# EAGLE design m365_led_source (EAGLE 9.1.3)
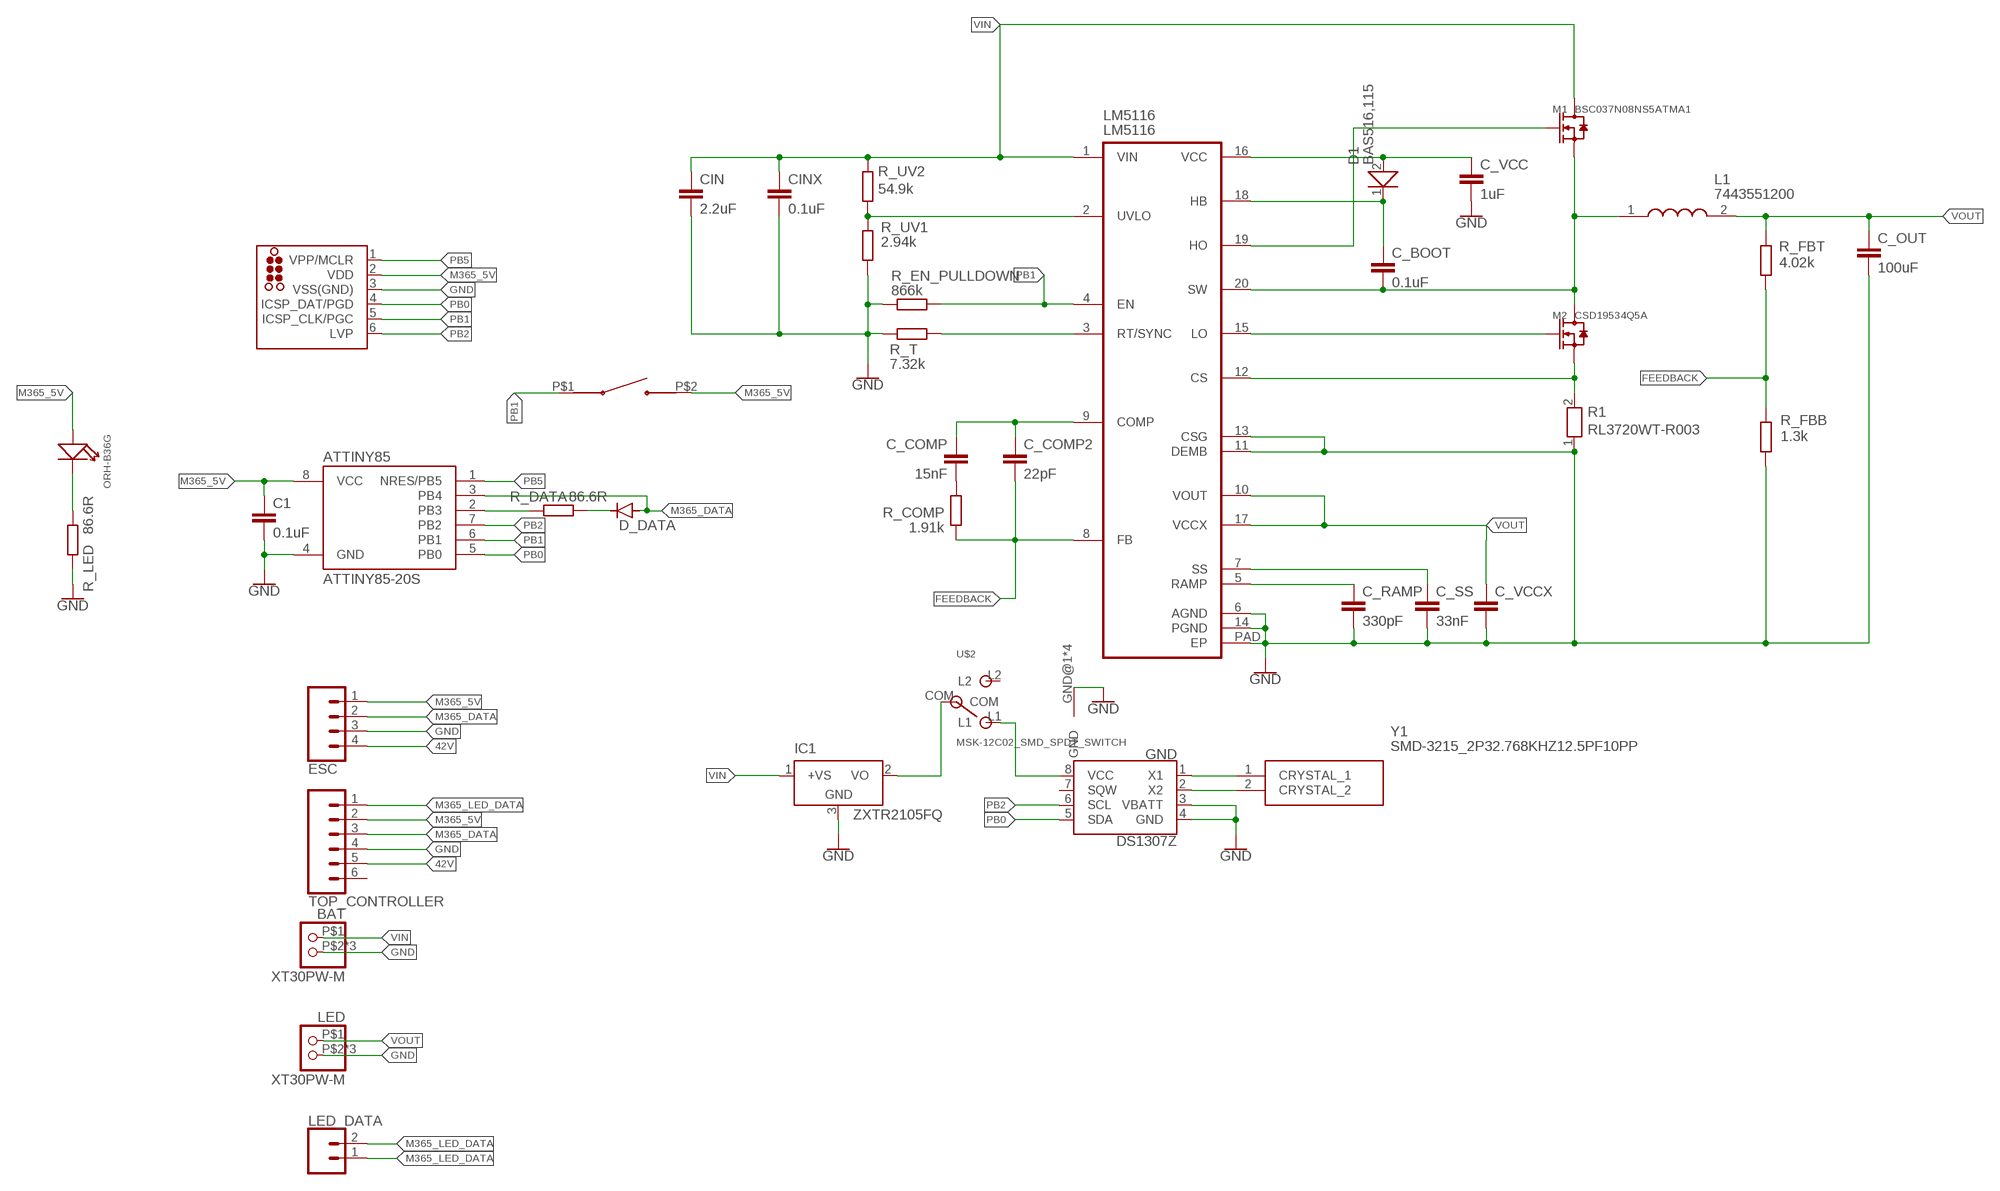
[diagram p0: schematic, sheet 1]

## Parts
ATTINY85  ATTINY85-20S  [SOIC8_EIAJ_208MIL]
BAT  XT30PW-M  [XT30PW-M]
C1  0.1uF  CC0402  [C0402]
C_BOOT  0.1uF  CC0603  [C0603]
C_COMP  15nF  CC1005  [C1005]
C_COMP2  22pF  CC0402  [C0402]
C_OUT  100uF  CC1210  [C1210]
C_RAMP  330pF  CC0402  [C0402]
C_SS  33nF  CC0402  [C0402]
C_VCC  1uF  CC0402  [C0402]
C_VCCX  CC0402  [C0402]
CIN  2.2uF  CC1210  [C1210]
CINX  0.1uF  CC0603  [C0603]
D1  BAS516,115  [SOD1608X65N]
D_DATA  SMAFJ75A  [SMAFJ75A]
ESC  CONN_04LONGPADS  [1X04_LONGPADS]
GND  DS1307Z  [SO08-0.15]
IC1  ZXTR2105FQ  LM50  [SOT23]
J2  TC2030-MCP-NL  [TC2030-MCP-NL]
L1  7443551200  [WE-HCI_1350/136523]
LED  XT30PW-M  [XT30PW-M]
LED_DATA  CONN_02PTH3  [1X02_LONGPADS]
LM5116  LM5116  [TSSOP20-PAD]
M1  BSC037N08NS5ATMA1  CSD19534Q5A  [CSD19531Q5AT]
M2  CSD19534Q5A  [CSD19531Q5AT]
R1  RL3720WT-R003  RL3720WT-R005-F  [RESC2038X70N]
R_COMP  1.91k  RR0402  [R0402]
R_DATA  86.6R  RR0402  [R0402]
R_EN_PULLDOWN  866k  RR0402  [R0402]
R_FBB  1.3k  RR1206  [R1206]
R_FBT  4.02k  RR1206  [R1206]
R_LED  86.6R  RR0402  [R0402]
R_T  7.32k  RR0402  [R0402]
R_UV1  2.94k  RR0402  [R0402]
R_UV2  54.9k  RR0402  [R0402]
TINY_LED  ORH-B36G  SMD-LED-CLEAR-BLUE(0603)  [LED-0603]
TOP_CONTROLLER  CONN_06LONGPADS  [1X06_LONGPADS]
U$1  TL3302BF260QJ  [TL3302BF260QJ]
U$2  MSK-12C02_SMD_SPDT_SWITCH  [MSK-12C02]
Y1  SMD-3215_2P32.768KHZ12.5PF10PP  [SMD3215_2P32768KHZ125PF10PPM]

## Nets
5V_REG: IC1.2(VO) U$2.COM
42V: ESC.4 TOP_CONTROLLER.5
FEEDBACK: C_COMP2.2 LM5116.8(FB) R_COMP.1 R_FBB.2 R_FBT.1
GND: ATTINY85.4(GND) BAT.P$2 BAT.P$3 BAT.P$4 C1.2 C_OUT.2 C_RAMP.2 C_SS.2 C_VCC.2 C_VCCX.2 CIN.2 CINX.2 ESC.3 GND.3(VBATT) GND.4(GND) IC1.3(GND) J2.3(VSS(GND)) LED.P$2 LED.P$3 LED.P$4 LM5116.6(AGND) LM5116.11(DEMB) LM5116.13(CSG) LM5116.14(PGND) LM5116.PAD(EP) R1.1 R_EN_PULLDOWN.1 R_FBB.1 R_LED.1 R_T.1 R_UV1.1 TOP_CONTROLLER.4 U$2.GND@1(GND) U$2.GND@2(GND) U$2.GND@3(GND) U$2.GND@4(GND)
M365_5V: ATTINY85.8(VCC) C1.1 ESC.1 J2.2(VDD) TINY_LED.+ TOP_CONTROLLER.2 U$1.P$2
M365_DATA: ATTINY85.3(PB4) D_DATA.P$2(ANODE) ESC.2 TOP_CONTROLLER.3
M365_LED_DATA: LED_DATA.1 LED_DATA.2 TOP_CONTROLLER.1
N$1: C_COMP.2 R_COMP.2
N$2: LM5116.2(UVLO) R_UV1.2 R_UV2.1
N$3: GND.8(VCC) U$2.L1
N$4: LM5116.3(RT/SYNC) R_T.2
N$5: C_COMP2.1 C_COMP.1 LM5116.9(COMP)
N$6: GND.1(X1) Y1.1(CRYSTAL_1)
N$7: C_SS.1 LM5116.7(SS)
N$8: C_RAMP.1 LM5116.5(RAMP)
N$9: R_LED.2 TINY_LED.-
N$10: D_DATA.P$1(CATHODE) R_DATA.2
N$11: GND.2(X2) Y1.2(CRYSTAL_2)
N$16: LM5116.12(CS) M2.1(S) M2.2(S) M2.3(S) R1.2
N$17: LM5116.15(LO) M2.4(G)
N$18: C_BOOT.2 L1.1 LM5116.20(SW) M1.1(S) M1.2(S) M1.3(S) M2.5(D) M2.6(D) M2.7(D) M2.8(D) M2.9(D)
N$19: LM5116.19(HO) M1.4(G)
N$20: C_BOOT.1 D1.1 LM5116.18(HB)
N$21: C_VCC.1 D1.2 LM5116.16(VCC)
PB0: ATTINY85.5(PB0) GND.5(SDA) J2.4(ICSP_DAT/PGD)
PB1: ATTINY85.6(PB1) J2.5(ICSP_CLK/PGC) LM5116.4(EN) R_EN_PULLDOWN.2 U$1.P$1
PB2: ATTINY85.7(PB2) GND.6(SCL) J2.6(LVP)
PB3: ATTINY85.2(PB3) R_DATA.1
PB5: ATTINY85.1(NRES/PB5) J2.1(VPP/MCLR)
VIN: BAT.P$1 CIN.1 CINX.1 IC1.1(+VS) LM5116.1(VIN) M1.5(D) M1.6(D) M1.7(D) M1.8(D) M1.9(D) R_UV2.2
VOUT: C_OUT.1 C_VCCX.1 L1.2 LED.P$1 LM5116.10(VOUT) LM5116.17(VCCX) R_FBT.2
Unconnected: GND.7(SQW) TOP_CONTROLLER.6 U$2.L2

## Library data of the parts
ATTINY85 = attiny25_45_85:ATTINY85*: ATMEL ATtiny 85 Packages: P = PDIP 08 30mil S = SOIC 08 EIAJ 208mil Technologies Note: for complete ordering code (temp. range, finish, tape&reel etc.) see www.atmel.com • Supply Voltage: V = (1.8…5.5)V | [blank] = (2.7…5.5)V • Speed: 10 = 10 MHz | 20 = 20 MHz Author: Dipl.-Ing. FH Rainer Bayer HHN Hochschule Heilbronn (Heilbronn University), rainer.bayer@hs-heilbronn.de Ingenieurbüro ing-rb, mail@ing-rb.de
BAT LED = my-lib:XT30PW-M
C1 C_BOOT C_COMP C_COMP2 C_OUT C_RAMP C_SS C_VCC C_VCCX CIN CINX = eagle-ltspice:C: CAPACITOR, European symbol; SPICEMODEL: NONE; SPICEPREFIX: C
D1 = BAS516_115:BAS516,115: NXP - BAS516,115 - DIODE, SWITCHING, 150MA, 100V, SOD-523 Source: Datasheet <http://www.mouser.com/ds/2/302/BAS16_SER-839896.pdf>; DESCRIPTION: NXP - BAS516,115 - DIODE, SWITCHING, 150MA, 100V, SOD-523; HEIGHT: 0.65mm; MANUFACTURER_NAME: Nexperia; MANUFACTURER_PART_NUMBER: BAS516,115; MOUSER_PART_NUMBER: 771-BAS516-T/R; MOUSER_PRICE-STOCK: https://www.mouser.com/Search/Refine.aspx?Keyword=771-BAS516-T%2FR; RS_PART_NUMBER: 0508282; RS_PRICE-STOCK: http://uk.rs-online.com/web/p/products/0508282
D_DATA = my-lib:SMAFJ75A
ESC = SparkFun-Connectors:CONN_04: Multi connection point. Often used as Generic Header-pin footprint for 0.1 inch spaced/style header connections On any of the 0.1 inch spaced packages, you can populate with these: Break Away Headers - Straight <https://www.sparkfun.com/products/116> (PRT-00116) Break Away Male Headers - Right Angle <https://www.sparkfun.com/products/553> (PRT-00553) Female Headers <https://www.sparkfun.com/products/115> (PRT-00115) Break Away Headers - Machine Pin <https://www.sparkfun.com/products/117> (PRT-00117) Break Away Female Headers - Swiss Machine Pin <https://www.sparkfun.com/products/743> (PRT-00743) For SCREWTERMINALS and SPRING TERMINALS visit here: Screw Terimnals on SparkFun.com <https://www.sparkfun.com/search/results?term=Screw+Terminals> (5mm/3.5mm/2.54mm spacing) This device is also useful as a general connection point to wire up your design to another part of your project. Our various solder wires solder well into these plated through hole pads. Hook-Up Wire - Assortment (Stranded, 22 AWG) <https://www.sparkfun.com/products/11375> (PRT-11375) Hook-Up Wire - Assortment (Solid Core, 22 AWG) <https://www.sparkfun.com/products/11367> (PRT-11367) View the entire wire category on our website here <https://www.sparkfun.com/categories/141> Special notes: Molex polarized connector foot print use with SKU : PRT-08231 with associated crimp pins and housings. 1MM SMD Version SKU: PRT-10208; PROD_ID: CONN-09696
GND = SparkFun-Clocks:DS1307: Maxim DS1307 - I2C Real-time clock (RTC) The DS1307 serial real-time clock (RTC) is a low-power, full binary-coded decimal (BCD) clock/calendar plus 56 bytes of NV SRAM. Address and data are transferred serially through an I2C, bidirectional bus. The clock/calendar provides seconds, minutes, hours, day, date, month, and year information. SparkFun Products: Real Time Clock Module <https://www.sparkfun.com/products/12708> (BOB-12708) Datasheet <https://cdn.sparkfun.com/datasheets/BreakoutBoards/DS1307.pdf>; PROD_ID: IC-08138
IC1 = linear:LM50: SOT-23 Single-Supply Centigrade Temperature Sensor Vout = (10mV/°C x Temp °C) +5mmmV Source: http://cache.national.com/ds/LM/LM50.pdf
J2 = tag-connect:TC2030: TAG-CONNECT ICSP Connector Manufacturer: Tag-Connect <http://www.tag-connect.com> Cable for easy In-Circuit Serial Programming. Designed for Microchip ICD2, suitable for many others. Two variants - one "with legs" (for hands-free fit on PCB) and another "without legs" for quick programming. PAD Description 1 MCLR/Vpp 2 Vdd 3 GND 4 PGD (ISPDAT) 5 PGC (ISPCLK) 6 nc (used for LVP) ©2009 ROFA.cz - modified and updated by Robert Darlington ‹rdarlington@gmail.com›
L1 = 7443551200:7443551200: Wurth WE-HCI Series Shielded Wire-wound SMD Inductor with a WE-Perm Core, 2 uH +/-20% Flat Wire Winding 23A Idc Source: Datasheet; DESCRIPTION: Wurth WE-HCI Series Shielded Wire-wound SMD Inductor with a WE-Perm Core, 2 uH +/-20% Flat Wire Winding 23A Idc; HEIGHT: mm; MANUFACTURER_NAME: Wurth Elektronik; MANUFACTURER_PART_NUMBER: 7443551200; MOUSER_PART_NUMBER: 710-7443551200; MOUSER_PRICE-STOCK: https://www.mouser.com/Search/Refine.aspx?Keyword=710-7443551200; RS_PART_NUMBER: 7362049P; RS_PRICE-STOCK: http://uk.rs-online.com/web/p/products/7362049P
LED_DATA = SparkFun-Connectors:CONN_02: Multi connection point. Often used as Generic Header-pin footprint for 0.1 inch spaced/style header connections On any of the 0.1 inch spaced packages, you can populate with these: Break Away Headers - Straight <https://www.sparkfun.com/products/116> (PRT-00116) Break Away Male Headers - Right Angle <https://www.sparkfun.com/products/553> (PRT-00553) Female Headers <https://www.sparkfun.com/products/115> (PRT-00115) Break Away Headers - Machine Pin <https://www.sparkfun.com/products/117> (PRT-00117) Break Away Female Headers - Swiss Machine Pin <https://www.sparkfun.com/products/743> (PRT-00743) For SCREWTERMINALS and SPRING TERMINALS visit here: Screw Terimnals on SparkFun.com <https://www.sparkfun.com/search/results?term=Screw+Terminals> (5mm/3.5mm/2.54mm spacing) This device is also useful as a general connection point to wire up your design to another part of your project. Our various solder wires solder well into these plated through hole pads. Hook-Up Wire - Assortment (Stranded, 22 AWG) <https://www.sparkfun.com/products/11375> (PRT-11375) Hook-Up Wire - Assortment (Solid Core, 22 AWG) <https://www.sparkfun.com/products/11367> (PRT-11367) View the entire wire category on our website here <https://www.sparkfun.com/categories/141> Special notes: Molex polarized connector foot print use with: PRT-08233 with associated crimp pins and housings. 2.54_SCREWTERM for use with PRT-10571. 3.5mm Screw Terminal footprints for PRT-08084 5mm Screw Terminal footprints for use with PRT-08432
LM5116 = newchips:LM5116: NS Wide Range Synchronous Buck Controller
M1 M2 = CSD19534Q5A:CSD19534Q5A: 100V, N ch NexFET MOSFET, single SON5x6, 15.1mOhm Source: Datasheet <http://www.ti.com/lit/ds/symlink/csd19534q5a.pdf>; DESCRIPTION: 100V, N ch NexFET MOSFET, single SON5x6, 15.1mOhm; HEIGHT: 1mm; MANUFACTURER_NAME: Texas Instruments; MANUFACTURER_PART_NUMBER: CSD19534Q5A; MOUSER_PART_NUMBER: 595-CSD19534Q5A; MOUSER_PRICE-STOCK: https://www.mouser.com/Search/Refine.aspx?Keyword=595-CSD19534Q5A
R1 = RL3720WT-R005-F:RL3720WT-R005-F: Current Sense Resistors - SMD 1W 0.005ohm 1% Source: Datasheet <http://www.mouser.com/ds/2/392/n_catalog_partition07_en-1114612.pdf>; DESCRIPTION: Current Sense Resistors - SMD 1W 0.005ohm 1%; HEIGHT: 0.7mm; MANUFACTURER_NAME: Susumu; MANUFACTURER_PART_NUMBER: RL3720WT-R005-F; MOUSER_PART_NUMBER: 754-RL3720WT-R005-F; MOUSER_PRICE-STOCK: https://www.mouser.com/Search/Refine.aspx?Keyword=754-RL3720WT-R005-F
R_COMP R_DATA R_EN_PULLDOWN R_FBB R_FBT R_LED R_T R_UV1 R_UV2 = eagle-ltspice:R: RESISTOR, European symbol; SPICEMODEL: NONE; SPICEPREFIX: R
TINY_LED = Seeed-LED:SMD-LED-CLEAR-BLUE(0603): 304090045; MPN: 19-217-BHC-ZL1M2RY-3T; VALUE: BLUE-0603
TOP_CONTROLLER = SparkFun-Connectors:CONN_06: Multi connection point. Often used as Generic Header-pin footprint for 0.1 inch spaced/style header connections On any of the 0.1 inch spaced packages, you can populate with these: Break Away Headers - Straight <https://www.sparkfun.com/products/116> (PRT-00116) Break Away Male Headers - Right Angle <https://www.sparkfun.com/products/553> (PRT-00553) Female Headers <https://www.sparkfun.com/products/115> (PRT-00115) Break Away Headers - Machine Pin <https://www.sparkfun.com/products/117> (PRT-00117) Break Away Female Headers - Swiss Machine Pin <https://www.sparkfun.com/products/743> (PRT-00743) Arduino Stackable Header - 6 Pin <https://www.sparkfun.com/products/9280> (PRT-09280) For SCREWTERMINALS and SPRING TERMINALS visit here: Screw Terimnals on SparkFun.com <https://www.sparkfun.com/search/results?term=Screw+Terminals> (5mm/3.5mm/2.54mm spacing) This device is also useful as a general connection point to wire up your design to another part of your project. Our various solder wires solder well into these plated through hole pads. Hook-Up Wire - Assortment (Stranded, 22 AWG) <https://www.sparkfun.com/products/11375> (PRT-11375) Hook-Up Wire - Assortment (Solid Core, 22 AWG) <https://www.sparkfun.com/products/11367> (PRT-11367) View the entire wire category on our website here <https://www.sparkfun.com/categories/141>
U$1 = my-lib:TL3302BF260QJ
U$2 = MSK-12C02 SMD Micro Slider Switch SPDT:MSK-12C02_SMD_SPDT_SWITCH: Footprint of the VIMEX MSK-12C02 SPDT SMD Switch Created by mzst on 17-Jan-2016
Y1 = SMD-3215_2P32.768KHZ12.5PF10PP:SMD-3215_2P32.768KHZ12.5PF10PP: SMD Crystal Resonators 32.768KHz +/-10ppm SMD-3215_2P RoHS Source: Datasheet <https://datasheet.lcsc.com/szlcsc/Zhejiang-Abel-Elec-SMD-3215-2P32-768KHZ12-5PF10PPM_C164062.pdf>; DESCRIPTION: SMD Crystal Resonators 32.768KHz +/-10ppm SMD-3215_2P RoHS; HEIGHT: 0.8mm; MANUFACTURER_NAME: Zhejiang Abel Elec; MANUFACTURER_PART_NUMBER: SMD-3215_2P32.768KHZ12.5PF10PPM

## Board
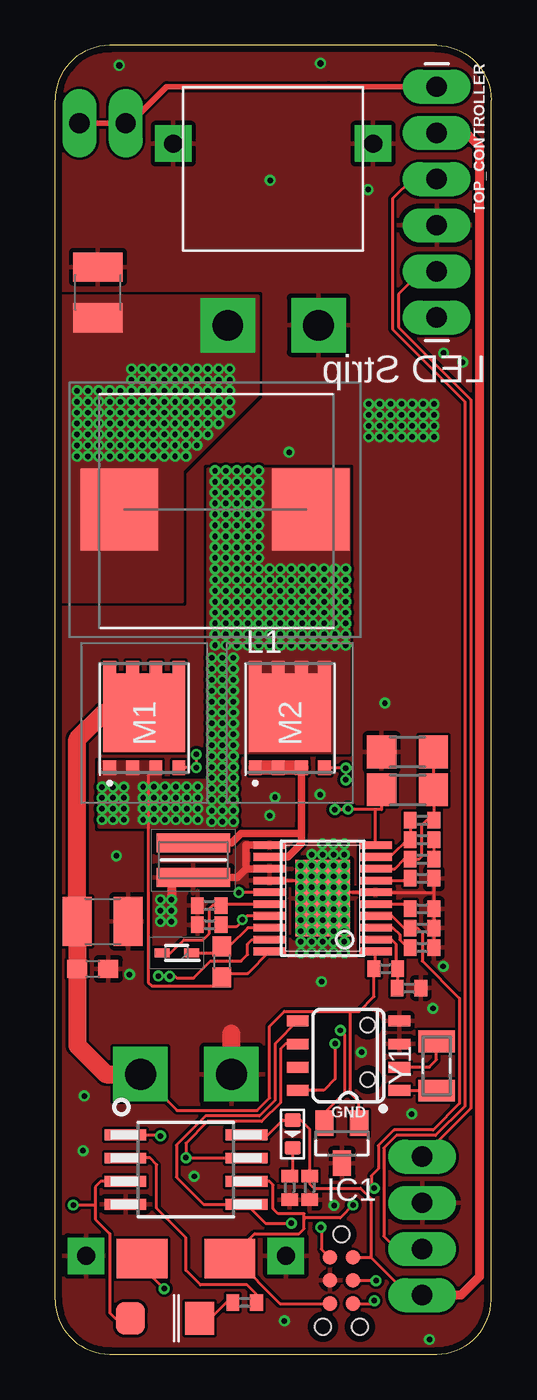
[diagram p1: board, top side]
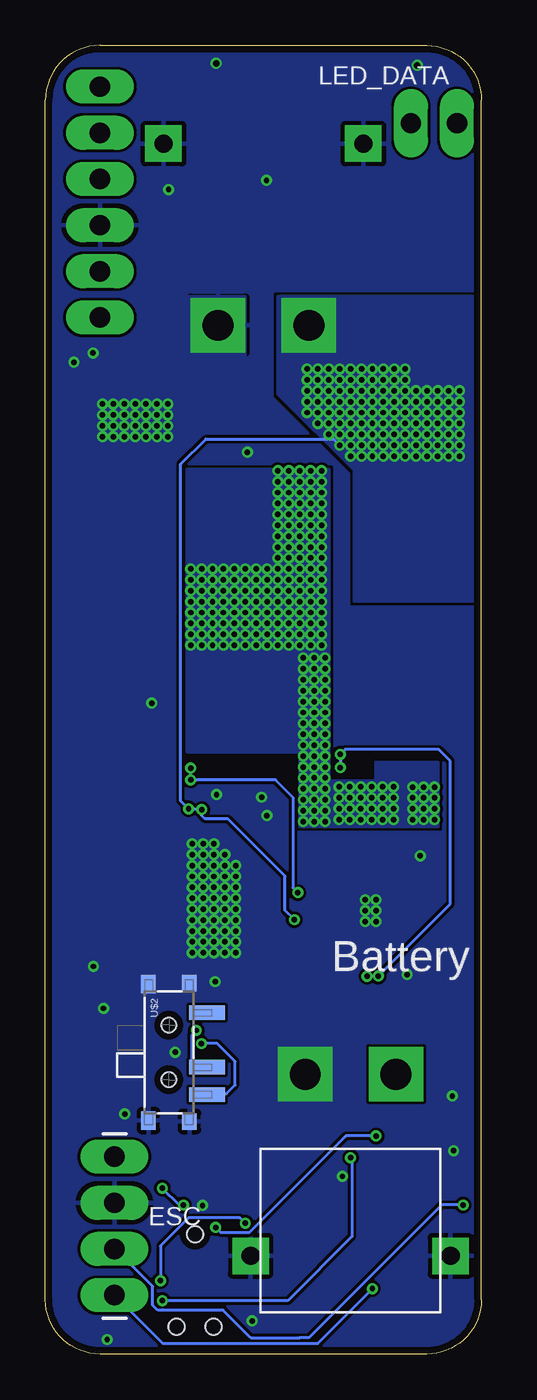
[diagram p2: board, bottom side, seen from below]

Size 24 x 72 mm. Coordinates in mm from the lower left corner, seen from the top.
Outline: 3,0 21,0 arc90 24,3 24,69 arc90 21,72 3,72 arc90 0,69 0,3 arc90 3,0
Copper layers (1*16): Top 0.035559375mm / dielectric 1.6mm / Bottom 0.035559375mm
Design rules "oshpark-2layer": minimum track width 6mil, minimum drill 10mil, track to track 6mil, track to pad 6mil, pad to pad 6mil, via to via 6mil, smd to smd 6mil, copper to edge 15mil, drill to drill 6mil, minimum pad ring 5mil, minimum via ring 5mil, stop-mask expansion 2.5mil, vias tented up to drill 0mil, thermal gap 10mil

### Footprints (pad centres in the part's own frame; a part is rotated, then mirrored left to right if it is on the bottom)
SOIC8_EIAJ_208MIL = smd 0.6 x 2.286: 1 -1.905,-3.33; 2 -0.635,-3.33; 3 0.635,-3.33; 4 1.905,-3.33; 5 1.905,3.33; 6 0.635,3.33; 7 -0.635,3.33; 8 -1.905,3.33
XT30PW-M = drill 1.7 pad 3 square: P$1 0,-2.5; P$2 0,2.5 | drill 1 pad 2 square: P$3 -10,5.5; P$4 -10,-5.5
C0402 = smd 0.7 x 0.9: 1 -0.65,0; 2 0.65,0
C0603 = smd 1.1 x 1: 1 -0.85,0; 2 0.85,0
C1005 = smd 0.7 x 0.9: 1 -0.65,0; 2 0.65,0
C1210 = smd 1.6 x 2.7: 1 -1.4,0; 2 1.4,0
SOD1608X65N = smd 0.818 x 0.5: 1 -0.808,0; 2 0.808,0
SMAFJ75A = smd 1.6 x 1.8: P$1 1.9,0; P$2 -1.9,0
1X04_LONGPADS = drill 1.118 pad 1.88 long: 1 0,0; 2 2.54,0; 3 5.08,0; 4 7.62,0
SO08-0.15 = smd 0.6 x 1.2: 1 -1.905,-2.8; 2 -0.635,-2.8; 3 0.635,-2.8; 4 1.905,-2.8; 5 1.905,2.8; 6 0.635,2.8; 7 -0.635,2.8; 8 -1.905,2.8
SOT23 = smd 1 x 1.4: 1 -0.95,-1.1; 2 0.95,-1.1; 3 0,1.1
TC2030-MCP-NL = smd 0.787 x 0.787: 1 1.27,-0.635; 2 1.27,0.635; 3 2.54,-0.635; 4 2.54,0.635; 5 3.81,-0.635; 6 3.81,0.635 | hole 0.889: 0,0; 5.08,-1.016; 5.08,1.016
WE-HCI_1350/136523 = smd 4.25 x 4.5: 1 -5.25,0; 2 5.27,0
1X02_LONGPADS = drill 1.118 pad 1.88 long: 1 0,0; 2 2.54,0
TSSOP20-PAD = smd 0.42 x 1.78: 1 -2.925,-2.918; 2 -2.275,-2.918; 3 -1.625,-2.918; 4 -0.975,-2.918; 5 -0.325,-2.918; 6 0.325,-2.918; 7 0.975,-2.918; 8 1.625,-2.918; 9 2.275,-2.918; 10 2.925,-2.918; 11 2.925,2.918; 12 2.275,2.918; 13 1.625,2.918; 14 0.975,2.918; 15 0.325,2.918; 16 -0.325,2.918; 17 -0.975,2.918; 18 -1.625,2.918; 19 -2.275,2.918; 20 -2.925,2.918 | smd 4.2 x 3: PAD 0,0
CSD19531Q5AT = smd 0.8 x 0.7: 1 -2.451,1.905; 2 -2.451,0.635; 3 -2.451,-0.635; 4 -2.451,-1.905 | smd 0.68 x 0.7: 5 3.064,-1.905; 6 3.064,-0.635; 7 3.064,0.635; 8 3.064,1.905 | smd 4.32 x 4.51: 9 0.564,0
RESC2038X70N = smd 1.05 x 4.05: 1 -0.95,0; 2 0.95,0
R0402 = smd 0.7 x 0.9: 1 -0.65,0; 2 0.65,0
R1206 = smd 1.6 x 1.803: 1 -1.422,0; 2 1.422,0
LED-0603 = smd 0.762 x 0.889: + -0.762,0; - 0.762,0
1X06_LONGPADS = drill 1.118 pad 1.88 long: 1 0,0; 2 2.54,0; 3 5.08,0; 4 7.62,0; 5 10.16,0; 6 12.7,0
TL3302BF260QJ = smd 2.795 x 2.16: P$1 -2.413,0; P$2 2.413,0
MSK-12C02 = smd 0.8 x 2: COM 0.823,2.1; L1 2.323,2.1; L2 -2.177,2.1 | smd 1 x 0.8: GND@1 -3.75,-1.125; GND@4 3.75,-1.125 | smd 0.9 x 0.8: GND@2 -3.8,1.125; GND@3 3.8,1.125 | hole 0.8: -1.5,0; 1.5,0
SMD3215_2P32768KHZ125PF10PPM = smd 1.2 x 2: 1 -1.35,0; 2 1.35,0

### Placement (x,y rotation side)
ATTINY85  7.2,10.15 270 top
BAT  7.2,15.4 90 bottom
C1  14.01,9.15 270 top
C_BOOT  9.17,21.58 270 top
C_COMP  20.19,28.3 0 top
C_COMP2  20.19,29.38 0 top
C_OUT  2.35,58.41 90 top
C_RAMP  20.19,24.5 0 top
C_SS  20.19,26.18 0 top
C_VCC  8.48,24.68 180 top
C_VCCX  8.48,23.62 180 top
CIN  2.62,23.81 0 top
CINX  2.07,21.19 0 top
D1  6.69,22.08 180 top
D_DATA  6.04,1.97 0 top
ESC  20.2,3.24 90 bottom
GND  16.15,16.42 90 top
IC1  15.78,11.6 180 top
J2  15.75,6.59 270 top
L1  8.81,46.46 180 top
LED  12,56.6 270 top
LED_DATA  3.88,67.72 0 bottom
LM5116  14.72,25.08 90 top
M1  4.9,34.72 90 top
M2  12.92,34.72 90 top
R1  7.6,27.18 90 top
R_COMP  20.19,27.23 0 top
R_DATA  10.43,2.84 180 top
R_EN_PULLDOWN  20.19,23.44 180 top
R_FBB  19.39,33.12 0 top
R_FBT  19.39,31.05 180 top
R_LED  12.91,9.15 90 top
R_T  20.19,22.37 180 top
R_UV1  19.48,20.14 180 top
R_UV2  18.2,21.2 180 top
TINY_LED  13.07,12.11 270 top
TOP_CONTROLLER  21,69.73 270 top
U$1  7.2,5.26 180 top
U$2  17.2,16.6 270 bottom
Y1  20.99,15.85 90 top

### Tracks (layer width: path | path; a pad name or v marks a point on that pad's centre or on a via)
5V_REG  (via drill 0.3 pad 0.6)
  Top 0.152: IC1.2 14.83,13.28 15.94,14.39 15.94,17.56 v15.69,17.81
  Bottom 0.152: v15.69,17.81 15.94,17.56 15.94,15.98 15.74,15.78 U$2.COM
42V
  Top 0.152: ESC.4 22.87,13.53 22.87,52.51 18.89,56.49 18.89,58.31 20.15,59.57 TOP_CONTROLLER.5
FEEDBACK
  Top 0.152: 17.66,26.73 LM5116.8 18.7,26.7 19.22,27.23 R_COMP.1 20.04,27.23 20.19,27.38 20.19,29.12 20.45,29.38 C_COMP2.2 20.84,31.03 R_FBT.1 R_FBB.2
GND  (via drill 0.3 pad 0.6, 0.35)
  Top 0.152: LM5116.14 14.14,26.05 | 14.72,25.4 14.72,25.48 14.14,26.05 | 14.72,25.4 LM5116.PAD | 13.49,26.7 14.14,26.05 | LM5116.6 14.72,25.41 14.72,25.4 | R_EN_PULLDOWN.1 | LM5116.6 | C_SS.2 20.84,25.4 | 20.84,25.4 C_RAMP.2 R_EN_PULLDOWN.1 | R_EN_PULLDOWN.1 R_T.1 | 20.84,25.4 20.84,25.41 LM5116.6 | R_LED.1 12.72,8.5
  Top 0.406: 10.5,26.7 LM5116.13 | LM5116.11 10.5,28 10.5,26.7 | 10.5,26.7 10.5,26.69 10.04,26.23 R1.1
  Top 0.5: v6.4,25 6.4,26.04 6.59,26.23 R1.1
  Top 1: BAT.P$2 9.7,17.64
  other vias: 4.09,20.88 11.81,29.63 17.26,51.67 17.86,51.67 18.46,51.67 17.26,52.27 17.86,52.27 18.46,52.27 19.06,52.27 19.66,52.27 20.26,52.27 20.86,52.27 19.06,51.67 19.66,51.67 20.26,51.67 20.86,51.67 20.26,51.07 20.86,51.07 20.26,50.47 20.86,50.47 19.66,51.07 15.92,23.28 13.52,23.28 14.12,23.28 14.72,23.28 15.32,23.28 15.92,26.88 13.52,26.88 14.12,26.88 14.72,26.88 15.32,26.88 15.92,26.28 13.52,26.28 14.12,26.28 14.72,26.28 15.32,26.28 15.92,25.68 13.52,25.68 14.12,25.68 14.72,25.68 15.32,25.68 15.92,25.08 13.52,25.08 14.12,25.08 14.72,25.08 15.32,25.08 15.92,24.48 13.52,24.48 14.12,24.48 14.72,24.48 15.32,24.48 15.92,23.88 13.52,23.88 14.12,23.88 14.72,23.88 15.32,23.88 15.92,28.08 14.72,28.08 15.32,28.08 15.92,27.48 14.12,27.48 14.72,27.48 15.32,27.48 15.92,22.68 13.52,22.68 14.12,22.68 14.72,22.68 15.32,22.68 15.92,22.08 13.52,22.08 14.12,22.08 14.72,22.08 15.32,22.08 14.58,30.78 12.1,30.64 5.8,25 5.8,24.4 6.4,24.4 6.4,23.8 5.8,23.8 12.88,49.62 3.37,27.41 20.6,0.8 1.6,14.2 12.62,1.83 17.26,50.47 17.86,50.47 18.46,50.47 17.26,51.07 17.86,51.07 18.46,51.07 19.06,51.07 19.06,50.47 19.66,50.47 18.15,35.82 22.43,54.57 21.38,55.08 11.83,64.58 17.22,64.07 21.36,21.33 14.6,71.01 3.53,70.9 7.65,9.78 15.35,8.18 20.8,19.02 1.53,11.19 14.66,20.49 19.63,13.21 16.86,16.61
  pour Top (rank 6): -12,-0.6 -12,-3.6 32.8,-3.6 32.8,73.4 24.8,73.4 -11.8,73.4 -11.8,-0.4
  pour Bottom (rank 6): -12.2,-0.6 -12.2,-3.6 32.6,-3.6 32.6,73.4 24.6,73.4 -12,73.4 -12,-0.4
  pour Bottom (no thermals): 8.2,13.4 12.8,13.4 13.2,13.8 13.2,19 13.8,19.6 23.2,19.6 25.6,19.6 26.2,20.2 26.2,58.2 13,58.2 13,53.6 17.2,49.4 17.2,29.8 16.4,29 14.4,29 11.6,26.2 11.6,24 7.6,20 7.6,19.8 7.6,13.8 8,13.4
M365_5V  (via drill 0.3 pad 0.6)
  Top 0.152: 12.91,13.03 TINY_LED.+ | ATTINY85.8 11.7,12.05 12.52,12.87 TINY_LED.+ | J2.2 17.2,5.32 17.37,5.32 | 17.37,5.32 17.39,5.32 19.47,3.24 ESC.1 | v6,3.6 4.79,4.81 U$1.P$2 | TINY_LED.+ 13.53,12.87 14.01,12.39 C1.1 14.01,9.37 14.25,9.13 16.81,9.13 17.37,8.57 17.37,5.32
  Top 0.5: 22.61,67.19 23.35,66.45 23.35,4.26 22.33,3.24 ESC.1
  Top 0.508: TOP_CONTROLLER.2 22.61,67.19
  Bottom 0.152: ESC.1 17.56,0.6 9,0.6 v6,3.6
M365_DATA  (via drill 0.3 pad 0.6)
  Top 0.152: D_DATA.P$2 3.29,1.97 3,2.26 3,6.62 2.2,7.42 2.2,8.2 | ATTINY85.3 2.52,9.52 2.2,9.2 2.2,8.2 | TOP_CONTROLLER.3 19.65,64.65 18.57,63.57 18.57,56.38 22.56,52.39 22.56,13.65 20.94,12.03 18.78,12.03 18.09,11.34 18.09,6.49 18.8,5.78 ESC.2 | v1,8.2 2.2,8.2
  Bottom 0.152: v1,8.2 2.19,8.2 9.48,0.91 10,0.91 12.71,0.91 14.21,2.41 17.81,2.41 18.09,2.69 18.09,3.72 20.15,5.78 ESC.2
M365_LED_DATA
  Top 0.152: 15.05,69.73
  Top 0.305: LED_DATA.2 LED_DATA.1 4.13,67.72 6.14,69.73 15.05,69.73 TOP_CONTROLLER.1
N$1
  Top 0.152: C_COMP.2 R_COMP.2
N$2
  Top 0.152: LM5116.2 18.52,22.8 18.76,22.56 18.76,21.29 R_UV2.1 18.83,21.18 R_UV1.2
N$3  (via drill 0.3 pad 0.6)
  Top 0.152: v15.41,17.08 15.41,15.14 14.79,14.52 GND.8
  Bottom 0.152: U$2.L1 15.04,14.34 14.02,14.34 13.55,14.8 13.55,16.09 14.54,17.08 v15.41,17.08
N$4
  Top 0.152: 18.42,23.45 LM5116.3 18.59,23.45 18.96,23.08 18.96,22.8 19.39,22.37 R_T.2
N$5
  Top 0.152: 17.65,27.37 LM5116.9 18.43,27.36 19.54,28.46 C_COMP.1 C_COMP2.1
N$6
  Top 0.152: GND.1 20.98,14.52 Y1.1
N$7
  Top 0.152: 17.66,26.07 LM5116.7 19.42,26.05 C_SS.1
N$8
  Top 0.152: C_RAMP.1 19.27,24.77 17.66,24.77 LM5116.5
N$9
  Top 0.152: TINY_LED.- 13.07,9.96 R_LED.2
N$10
  Top 0.152: D_DATA.P$1 8.55,1.97 9.42,2.84 R_DATA.2
N$11
  Top 0.152: GND.2 18.96,15.8 20.6,15.8 20.99,16.19 Y1.2
N$16
  Top 0.406: 10.96,32.21 M2.1 | 12.78,32.24 12.81,32.27 | LM5116.12 12.81,27.36 13.55,28.1 13.55,29.18 | 13.55,29.18 13.55,28.66 10.23,28.66 9.71,28.13 R1.2 | M2.3 13.55,29.18
  Top 0.8: M2.1 M2.2 12.81,32.27 M2.3
N$17  (via drill 0.3 pad 0.6)
  Top 0.152: LM5116.15 v10.11,25.41 v10.11,25.4 | M2.4 14.85,32.24 v16,32.24 v16,31.59
  Bottom 0.152: v10.11,25.4 10.38,25.67 10.38,30.64 11.33,31.59 v16,31.59 v16,32.24
N$18  (via drill 0.3 pad 0.6)
  Top 0.152: LM5116.20 10.6,20.95 9.39,20.95 C_BOOT.2 8.7,20.26 5.3,20.26 5.12,20.43 5.12,31.86 M1.3
  other vias: 8.8,41.4 9.4,41.4 10,41.4 10.6,41.4 11.2,41.4 11.8,41.4 12.4,41.4 13,41.4 13.6,41.4 14.2,41.4 14.8,41.4 15.4,41.4 16,41.4 8.8,39 9.4,39 10,39 10.6,39 11.2,39 11.8,39 12.4,39 13,39 13.6,39 14.2,39 14.8,39 15.4,39 16,39 8.8,39.6 9.4,39.6 10,39.6 10.6,39.6 11.2,39.6 11.8,39.6 12.4,39.6 13,39.6 13.6,39.6 14.2,39.6 14.8,39.6 15.4,39.6 16,39.6 8.8,40.2 9.4,40.2 10,40.2 10.6,40.2 11.2,40.2 11.8,40.2 12.4,40.2 13,40.2 13.6,40.2 14.2,40.2 14.8,40.2 15.4,40.2 16,40.2 8.8,40.8 9.4,40.8 10,40.8 10.6,40.8 11.2,40.8 11.8,40.8 12.4,40.8 13,40.8 13.6,40.8 14.2,40.8 14.8,40.8 15.4,40.8 16,40.8 8.8,42 9.4,42 10,42 10.6,42 11.2,42 11.8,42 12.4,42 13,42 13.6,42 14.2,42 14.8,42 15.4,42 16,42 8.8,42.6 9.4,42.6 10,42.6 10.6,42.6 11.2,42.6 11.8,42.6 12.4,42.6 13,42.6 13.6,42.6 14.2,42.6 14.8,42.6 15.4,42.6 16,42.6 8.8,43.2 9.4,43.2 10,43.2 10.6,43.2 11.2,43.2 11.8,43.2 12.4,43.2 13,43.2 13.6,43.2 14.2,43.2 14.8,43.2 15.4,43.2 16,43.2 6.04,30.61 6.04,30.01 6.04,29.41 6.64,30.61 6.64,30.01 6.64,29.41 7.24,30.61 7.24,30.01 7.24,29.41 8.61,32.3 8.61,31.7 8.61,31.1 9.21,32.3 9.21,31.7 9.21,31.1 9.81,32.3 9.81,31.7 9.81,31.1 3.18,30.6 3.18,30 3.18,29.4 3.78,30.6 3.78,30 3.78,29.4 4.84,30.61 4.84,30.01 4.84,29.41 5.44,30.61 5.44,30.01 5.44,29.41 3.18,31.2 3.78,31.2 4.84,31.21 5.44,31.21 8.61,30.5 8.61,29.9 8.61,29.3 9.21,30.5 9.21,29.9 9.21,29.3 9.81,30.5 9.81,29.9 9.81,29.3 8.61,38.3 9.21,38.3 9.81,38.3 8.61,37.7 8.61,37.1 8.61,36.5 9.21,37.7 9.21,37.1 9.21,36.5 9.81,37.7 9.81,37.1 9.81,36.5 8.61,35.9 8.61,35.3 8.61,34.7 9.21,35.9 9.21,35.3 9.21,34.7 9.81,35.9 9.81,35.3 9.81,34.7 8.61,34.1 8.61,33.5 8.61,32.9 9.21,34.1 9.21,33.5 9.21,32.9 9.81,34.1 9.81,33.5 9.81,32.9 8.8,46.2 9.4,46.2 10,46.2 10.6,46.2 8.8,43.8 9.4,43.8 10,43.8 10.6,43.8 8.8,44.4 9.4,44.4 10,44.4 10.6,44.4 8.8,45 9.4,45 10,45 10.6,45 8.8,45.6 9.4,45.6 10,45.6 10.6,45.6 8.8,46.8 9.4,46.8 10,46.8 10.6,46.8 8.8,47.4 9.4,47.4 10,47.4 10.6,47.4 8.8,48 9.4,48 10,48 10.6,48 11.2,46.2 11.2,43.8 11.2,44.4 11.2,45 11.2,45.6 11.2,46.8 11.2,47.4 11.2,48 11.2,48.6 8.8,48.6 9.4,48.6 10,48.6 10.6,48.6 7.84,30.61 7.84,30.01 7.84,29.41 2.58,30.6 2.58,30 2.58,29.4 2.58,31.2 7.84,31.21 7.24,31.21 6.64,31.21 6.04,31.21
  pour Bottom (no thermals): 2.4,31.09 2.4,29 7.4,29 9.83,29 10,29 10,30.2 10,33.11 16.2,33.11 16.2,36 16.2,48.7 8.4,48.7 8.4,32.91 8.4,31.55 5.81,31.55 5.81,32.59 2.4,32.59
  pour Top (no thermals): 2.4,31.09 2.4,29 7.4,29 9.83,29 10,29 10,30.2 10,33.11 16.2,33.11 16.2,36 16.2,48.7 8.4,48.7 8.4,32.91 8.4,31.55 5.81,31.55 5.81,32.59 2.4,32.59
N$19  (via drill 0.3 pad 0.6)
  Top 0.152: M1.4 v7.77,32.27 v7.77,33 | LM5116.19 10.85,22.8 10.6,22.56 10.6,21.98 10.24,21.62 8.55,21.62 7.62,20.69 6.69,20.69 6.58,20.8 v5.68,20.8
  Bottom 0.152: v7.77,32.27 v7.77,33 7.51,33.26 2.35,33.26 1.71,32.62 1.71,24.77 v5.68,20.8 v5.69,20.79 v6.3,20.79
N$20
  Top 0.152: LM5116.18 | C_BOOT.1 9.17,22.2 | 10.91,23.45 LM5116.18 | C_BOOT.1 9.58,22.43 10.6,23.45 LM5116.18 | D1.1 8.82,22.08 C_BOOT.1
N$21
  Top 0.152: 9.29,24.84 C_VCC.1 | C_VCC.1 8.66,24.68 8.49,24.51 8.49,23.16 8.13,22.8 7.08,22.8 6.36,22.08 D1.2 | LM5116.16 9.2,24.75 C_VCC.1
PB0  (via drill 0.3 pad 0.6)
  Top 0.152: v13,7.2 11.57,7.2 ATTINY85.5 8.15,8.24 6.67,9.73 6.67,11.5 8.26,13.1 11.24,13.1 12.11,13.96 12.11,17.08 GND.5 | v17.66,4.04 J2.4
  Bottom 0.152: v17.66,4.04 17.66,5.96 16.12,7.49 13.29,7.49 v13,7.2
PB1  (via drill 0.3 pad 0.6)
  Top 0.152: LM5116.4 18.54,24.11 19.21,23.44 R_EN_PULLDOWN.2 | R_EN_PULLDOWN.2 19.71,23.44 | R_EN_PULLDOWN.2 19.94,23.44 20.2,23.18 20.2,21.62 22.25,19.57 22.25,13.78 20.8,12.33 18.65,12.33 17.79,11.47 17.79,10.19 17.4,9.8 17.4,9.29 v17.56,9.12 | J2.5 12.38,2.78 9.9,5.26 U$1.P$1 10.98,6.63 13.43,6.63 13.7,6.9 13.7,7.4 | 13.7,7.4 13.7,7.49 15.69,7.49 v16.4,8.2 | 13.7,7.4 13.7,7.73 12.27,7.73 12,8 12,9.31 11.79,9.52 ATTINY85.6
  Bottom 0.152: v17.56,9.12 16.64,8.2 v16.4,8.2
PB2  (via drill 0.3 pad 0.6)
  Top 0.152: J2.6 17.4,2.78 v17.56,2.94 | ATTINY85.7 10.52,10.8 v7.2,10.8 7.2,11.6 8.39,12.79 11.37,12.79 12.41,13.83 12.41,16.8 12.66,17.05 GND.6
  Bottom 0.152: v17.56,2.94 10.66,2.94 7.12,6.48 7.12,10.72 v7.2,10.8
PB3
  Top 0.152: ATTINY85.2 5.22,10.79 5.59,10.42 5.59,8.01 7.2,6.4 7.2,4.6 8,3.8 10.56,3.8 11.08,3.28 R_DATA.1
PB5  (via drill 0.3 pad 0.6)
  Top 0.152: ATTINY85.1 5.75,12.05 v5.8,12 | v14.62,6.96 14.65,6.94 14.65,5.78 15.11,5.32 J2.1
  Bottom 0.152: v5.8,12 7.45,12 12.78,6.67 14.33,6.67 v14.62,6.96
VIN
  Top 0.152: M1.8 3,37.19 4.26,35.92 | 4.86,35.32 M1.9 | M1.7 4.26,35.92 | 4.26,35.92 4.86,35.32 | M1.6 5.54,35.99 | 5.54,35.99 4.86,35.32 | M1.5 6.8,37.27 5.54,35.99 | LM5116.1 17.64,21.4 17.42,21.18 17.44,21.2 R_UV2.2 | BAT.P$1 6.7,13.4 11.11,13.4 11.8,14.09 11.8,18.04 12.62,18.86 15.2,18.86 16.25,18.86 | 17.55,21.08 R_UV2.2 | 16.99,12.96 IC1.1 16.73,13.87 16.25,14.35 16.25,18.86 | 16.25,18.86 16.74,18.86 17.55,19.67 R_UV2.2
  Top 1: M1.9 2.67,35.28 1.22,33.83 CIN.1 | 1.27,23.86 CIN.1 | CIN.1 CINX.1 1.22,16.98 2.8,15.4 BAT.P$1
VOUT  (via drill 0.3 pad 0.6)
  Top 0.152: C_VCCX.1 9.24,23.5 9.97,23.5 10.33,23.87 | 10.33,23.87 10.57,24.11 LM5116.17 | 10.33,23.87 v10.3,23.9 | v15.39,29.95 15.41,29.93 16.07,29.93 v16.12,29.99 v16.12,30 16.16,29.96 17.64,29.96 | LM5116.10 17.64,29.96 | R_FBT.2 17.97,29.96 17.64,29.96
  Bottom 0.152: v10.3,23.9 10.8,24.4 10.8,26.3 13.95,29.45 15.2,29.45 15.39,29.64 v15.39,29.95 16.07,29.95 16.55,30.43 16.55,48.96 15.16,50.35 8.15,50.35 v7.8,50
  other vias: 7.2,49.4 6.6,49.4 6,49.4 5.4,49.4 2.4,49.4 1.8,49.4 1.2,49.4 4.8,49.4 4.2,49.4 3.6,49.4 3,49.4 7.2,51.8 6.6,51.8 6,51.8 5.4,51.8 2.4,51.8 1.8,51.8 1.2,51.8 4.8,51.8 4.2,51.8 3.6,51.8 3,51.8 7.2,51.2 6.6,51.2 6,51.2 5.4,51.2 2.4,51.2 1.8,51.2 1.2,51.2 4.8,51.2 4.2,51.2 3.6,51.2 3,51.2 7.2,50.6 6.6,50.6 6,50.6 5.4,50.6 2.4,50.6 1.8,50.6 1.2,50.6 4.8,50.6 4.2,50.6 3.6,50.6 3,50.6 7.2,50 6.6,50 6,50 5.4,50 2.4,50 1.8,50 1.2,50 4.8,50 4.2,50 3.6,50 3,50 7.8,50.6 8.4,50.6 8.4,51.2 7.8,51.2 7.8,51.8 8.4,51.8 9,51.8 9,51.2 9.6,51.8 9.6,52.4 9.6,53 9.6,53.6 9.6,54.2 9,54.2 9,53.6 9,53 9,52.4 8.4,52.4 8.4,53 8.4,53.6 8.4,54.2 7.8,54.2 7.8,53.6 7.2,53.6 6.6,53.6 6,53.6 5.4,53.6 4.8,53.6 4.2,53.6 7.2,54.2 6.6,54.2 6,54.2 5.4,54.2 4.8,54.2 4.2,54.2 7.2,53 6.6,53 6,53 5.4,53 2.4,53 1.8,53 1.2,53 4.8,53 4.2,53 3.6,53 3,53 7.2,52.4 6.6,52.4 6,52.4 5.4,52.4 2.4,52.4 1.8,52.4 1.2,52.4 4.8,52.4 4.2,52.4 3.6,52.4 3,52.4 7.8,52.4 7.8,53
  pour Top (no thermals): -1.2,58.2 -1.2,41.4 7,41.4 7,48.6 11.2,52.8 11.2,54.2 11.2,58.2 6.4,58.2 0.2,58.2
  pour Bottom (no thermals): -1.2,58.2 -1.2,41.4 7,41.4 7,48.6 11.2,52.8 11.2,56.44 11.2,58.2 6.4,58.2 4.2,58.2

### Text on the board
tNames: LED Strip
bNames: Battery